# Altium schematic sheet RK3588_PCIE20_30.SchDoc
size 594 x 420 mm; SheetNumber: 9; SheetTotal: 23
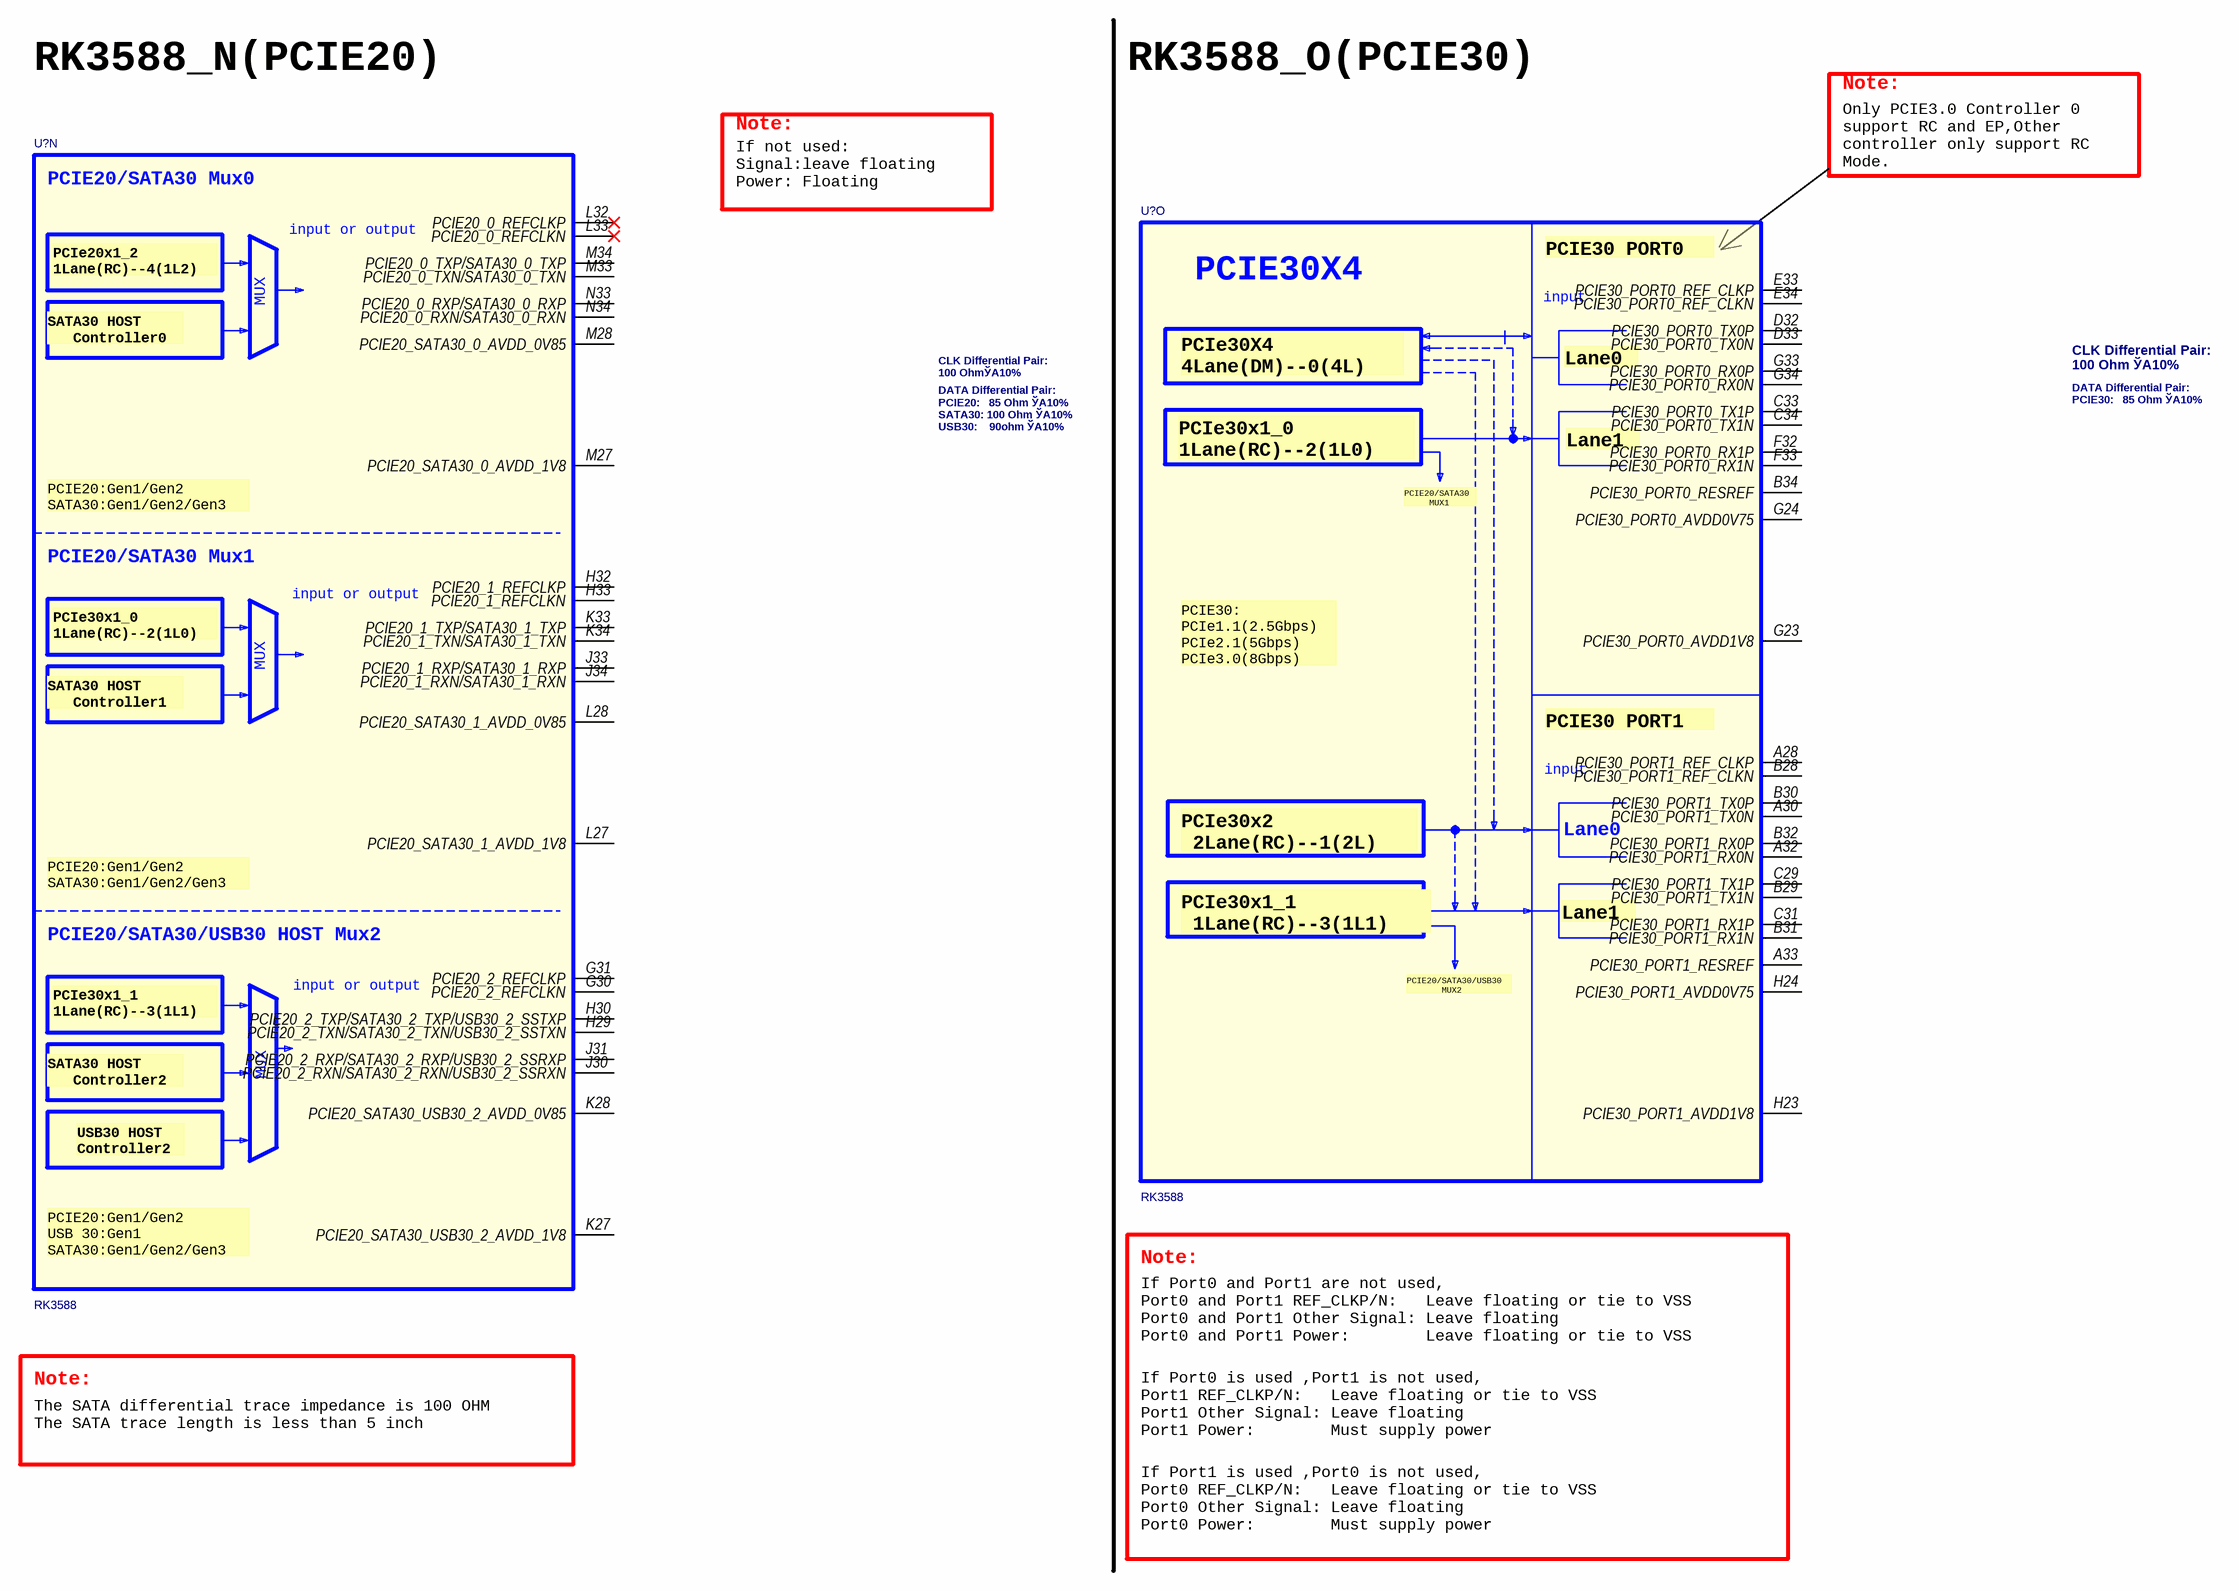
[diagram p0: RK3588_PCIE20_30.SchDoc]

## Parts
(Parts that share a designator on the sheet are numbered #1, #2 ... from top to bottom, then left to right.)
U?#1  RK3588  [BGA1088_23R00X23R00X2R00]  (part N of 26)
U?#2  RK3588  [BGA1088_23R00X23R00X2R00]  (part O of 26)

## Nets

Not connected (* = marked no-connect by the designer): U?#1 G30(PCIE20_2_REFCLKN) G31(PCIE20_2_REFCLKP) H29(PCIE20_2_TXN/SATA30_2_TXN/USB30_2_SSTXN) H30(PCIE20_2_TXP/SATA30_2_TXP/USB30_2_SSTXP) H32(PCIE20_1_REFCLKP) H33(PCIE20_1_REFCLKN) J30(PCIE20_2_RXN/SATA30_2_RXN/USB30_2_SSRXN) J31(PCIE20_2_RXP/SATA30_2_RXP/USB30_2_SSRXP) J33(PCIE20_1_RXP/SATA30_1_RXP) J34(PCIE20_1_RXN/SATA30_1_RXN) K27(PCIE20_SATA30_USB30_2_AVDD_1V8) K28(PCIE20_SATA30_USB30_2_AVDD_0V85) K33(PCIE20_1_TXP/SATA30_1_TXP) K34(PCIE20_1_TXN/SATA30_1_TXN) L27(PCIE20_SATA30_1_AVDD_1V8) L28(PCIE20_SATA30_1_AVDD_0V85) L32(PCIE20_0_REFCLKP)* L33(PCIE20_0_REFCLKN)* M27(PCIE20_SATA30_0_AVDD_1V8) M28(PCIE20_SATA30_0_AVDD_0V85) M33(PCIE20_0_TXN/SATA30_0_TXN) M34(PCIE20_0_TXP/SATA30_0_TXP) N33(PCIE20_0_RXP/SATA30_0_RXP) N34(PCIE20_0_RXN/SATA30_0_RXN); U?#2 A28(PCIE30_PORT1_REF_CLKP) A30(PCIE30_PORT1_TX0N) A32(PCIE30_PORT1_RX0N) A33(PCIE30_PORT1_RESREF) B28(PCIE30_PORT1_REF_CLKN) B29(PCIE30_PORT1_TX1N) B30(PCIE30_PORT1_TX0P) B31(PCIE30_PORT1_RX1N) B32(PCIE30_PORT1_RX0P) B34(PCIE30_PORT0_RESREF) C29(PCIE30_PORT1_TX1P) C31(PCIE30_PORT1_RX1P) C33(PCIE30_PORT0_TX1P) C34(PCIE30_PORT0_TX1N) D32(PCIE30_PORT0_TX0P) D33(PCIE30_PORT0_TX0N) E33(PCIE30_PORT0_REF_CLKP) E34(PCIE30_PORT0_REF_CLKN) F32(PCIE30_PORT0_RX1P) F33(PCIE30_PORT0_RX1N) G23(PCIE30_PORT0_AVDD1V8) G24(PCIE30_PORT0_AVDD0V75) G33(PCIE30_PORT0_RX0P) G34(PCIE30_PORT0_RX0N) H23(PCIE30_PORT1_AVDD1V8) H24(PCIE30_PORT1_AVDD0V75)

## Notes on the sheet
- RK3588_N(PCIE20)
- RK3588_O(PCIE30)
- Note:
- If not used:
  Signal:leave floating
  Power: Floating
- Only PCIE3.0 Controller 0
  support RC and EP,Other
  controller only support RC
  Mode.
- CLK Differential Pair:
  100 OhmЎА10%
- CLK Differential Pair:
  100 Ohm ЎА10%
- DATA Differential Pair:
  PCIE30:   85 Ohm ЎА10%
- DATA Differential Pair:
  PCIE20:   85 Ohm ЎА10%
  SATA30: 100 Ohm ЎА10%
  USB30:    90ohm ЎА10%
- If Port0 and Port1 are not used,
  Port0 and Port1 REF_CLKP/N:   Leave floating or tie to VSS
  Port0 and Port1 Other Signal: Leave floating
  Port0 and Port1 Power:        Leave floating or tie to VSS
- The SATA differential trace impedance is 100 OHM
  The SATA trace length is less than 5 inch
- If Port0 is used ,Port1 is not used,
  Port1 REF_CLKP/N:   Leave floating or tie to VSS
  Port1 Other Signal: Leave floating
  Port1 Power:        Must supply power
- If Port1 is used ,Port0 is not used,
  Port0 REF_CLKP/N:   Leave floating or tie to VSS
  Port0 Other Signal: Leave floating
  Port0 Power:        Must supply power
- 420x594
- Формат А2
- (in symbol SOC_RK3588, part N) PCIE20/SATA30 Mux0; input or output; PCIe20x1_2 / 1Lane(RC)--4(1L2); MUX; SATA30 HOST / Controller0; PCIE20:Gen1/Gen2 / SATA30:Gen1/Gen2/Gen3; PCIE20/SATA30 Mux1; PCIe30x1_0 / 1Lane(RC)--2(1L0); SATA30 HOST / Controller1; PCIE20/SATA30/USB30 HOST Mux2; PCIe30x1_1 / 1Lane(RC)--3(1L1); SATA30 HOST / Controller2; USB30 HOST / Controller2; PCIE20:Gen1/Gen2 / USB 30:Gen1 / SATA30:Gen1/Gen2/Gen3
- (in symbol SOC_RK3588, part O) PCIE30 PORT0 /; PCIE30X4; input; Lane0 /; PCIe30X4 / 4Lane(DM)--0(4L); Lane1 /; PCIe30x1_0 / 1Lane(RC)--2(1L0); PCIE20/SATA30 / MUX1; PCIE30: / PCIe1.1(2.5Gbps) / PCIe2.1(5Gbps) / PCIe3.0(8Gbps) /; PCIE30 PORT1 /; Lane0; PCIe30x2 / 2Lane(RC)--1(2L); PCIe30x1_1 / 1Lane(RC)--3(1L1); PCIE20/SATA30/USB30 / MUX2

## Library data of the parts
U?#1 U?#2 = SOC_RK3588: ROCKCHIP SOC; Part Reference: U1000; Manufacturer: Rockchip (ИрРѕОў); SWAP_INFO: (S1+S2+S3+S4+S5+S6+S7+S8+S9+S10+S11+S12+S13+S14+S15+S16+S17+S18+S19+S20+S21+S22+S23+S24+S25+S26); SPLIT_INST: TRUE; Priority: A; Value: RK3588; Created by: YWQ; Manufacturer PN: RK3588; Part Type: SOC; RK PN: RK3588; PCB Footprint: BGA1088_23R00X23R00X2R00